# Altium schematic sheet DriverCircuit.SchDoc
size A4
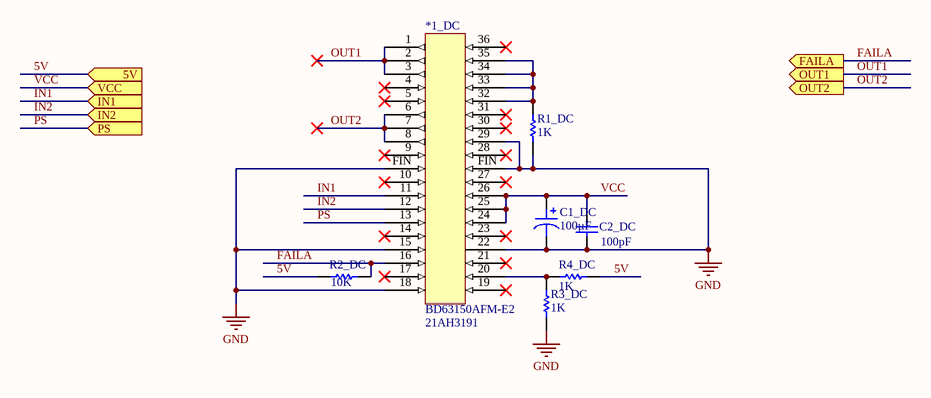
[diagram p0: DriverCircuit.SchDoc]

## Parts
*1_DC  BD63150AFM-E2  Supplier Part Number 1: 21AH3191  [Rohm_HSOP-M36_MFG]
C1_DC  100µF  [CAP ALSMD 6.6MM H6.1MM]
C2_DC  value 100pF  [1608[0603]]  (hidden comment: Cap)
R1_DC  value 1K  [1608[0603]]  (hidden comment: Res1)
R2_DC  value 10K  [1608[0603]]  (hidden comment: Res1)
R3_DC  value 1K  [1608[0603]]  (hidden comment: Res1)
R4_DC  value 1K  [1608[0603]]  (hidden comment: Res1)

## Ports
5V (in), FAILA (out), IN1 (in), IN2 (in), OUT1 (out), OUT2 (out), PS (in), VCC (in)

## Nets
GND: *1_DC.15 *1_DC.18 *1_DC.22 *1_DC.29 *1_DC.FIN C1_DC.2 C2_DC.1 R1_DC.2 R3_DC.2
5V: R2_DC.1 R4_DC.1 ; port 5V
FAILA: *1_DC.16 R2_DC.2 ; port FAILA
IN1: *1_DC.11 ; port IN1
IN2: *1_DC.12 ; port IN2
OUT1: *1_DC.1 *1_DC.2 *1_DC.3 ; port OUT1
OUT2: *1_DC.6 *1_DC.7 *1_DC.8 ; port OUT2
PS: *1_DC.13 ; port PS
VCC: *1_DC.24 *1_DC.25 *1_DC.26 C1_DC.1 C2_DC.2 ; port VCC
Net*1_DC_20: *1_DC.20 R3_DC.1 R4_DC.2
Net*1_DC_32: *1_DC.32 *1_DC.33 *1_DC.34 *1_DC.35 R1_DC.1

Not connected (* = marked no-connect by the designer): *1_DC 4* 5* 9* 10* 14* 17* 19* 21* 23* 27* 28* 30* 31* 36*

## Library data of the parts
*1_DC = BD63150AFM-E2: DC Driver; Supplier 1: Newark
C1_DC = UWZ1A101MCL1GB: CAP ALUM 100UF 20% 10V SMD; Manufacturer: Nichicon; Lifetime @ Temp.: 1000 Hrs @ 105°C; Polarization: Polar; Ripple Current @ High Frequency: 90mA @ 10kHz; Ripple Current @ Low Frequency: 60mA @ 120Hz; Surface Mount Land Size: 0.260" L x 0.260" W (6.60mm x 6.60mm); Part Number: UWZ1A101MCL1GB; Applications: High Temperature Reflow; Capacitance: 100µF; ComponentLink1Description: Datasheet; ComponentLink1URL: http://nichicon-us.com/english/products/pdfs/e-uwz.pdf; ComponentLink2Description: DigiKey Link; ComponentLink2URL: http://digikey.com/product-detail/en/nichicon/UWZ1A101MCL1GB/493-9991-1-ND/3973963; Device Package: Radial, Can - SMD; Height - Seated (Max): 0.224" (5.70mm); LastUpdated: 02.09.2020 01:18:40; Lifecycle Status: Active; Minimum Order: 1; Mounting Type: Surface Mount; Operating Temperature: -55°C ~ 105°C; Package / Case: Radial, Can - SMD; Packaging: TapeAndReel; PartId: 9046; Part Status: Active; Price: 0.11; Series: UWZ; Size / Dimension: 0.248" Dia (6.30mm); Supplier 1: DigiKey; Supplier Part Number 1: 493-9991-1-ND; Tolerance: ±20%; Value: 100µF; Voltage - Rated: 10V
C2_DC = Cap: Capacitor; Published: 8-Jun-2000; LatestRevisionDate: 17-Jul-2002; LatestRevisionNote: Re-released for DXP Platform.; PackageReference: RAD-0.3; Publisher: Altium Limited; PackageDescription: Radial Cap, Thru-Hole; 2 Leads; 0.3 in Pin Spacing
R1_DC R2_DC R3_DC R4_DC = Res1: Resistor; Published: 8-Jun-2000; LatestRevisionDate: 17-Jul-2002; LatestRevisionNote: Re-released for DXP Platform.; PackageReference: AXIAL-0.3; Publisher: Altium Limited; PackageDescription: Axial Device, Thru-Hole; 2 Leads; 0.3 in Pin Spacing